# EAGLE design BreakoutBoard (EAGLE 9.6.2)

## Sheet 1 of 2
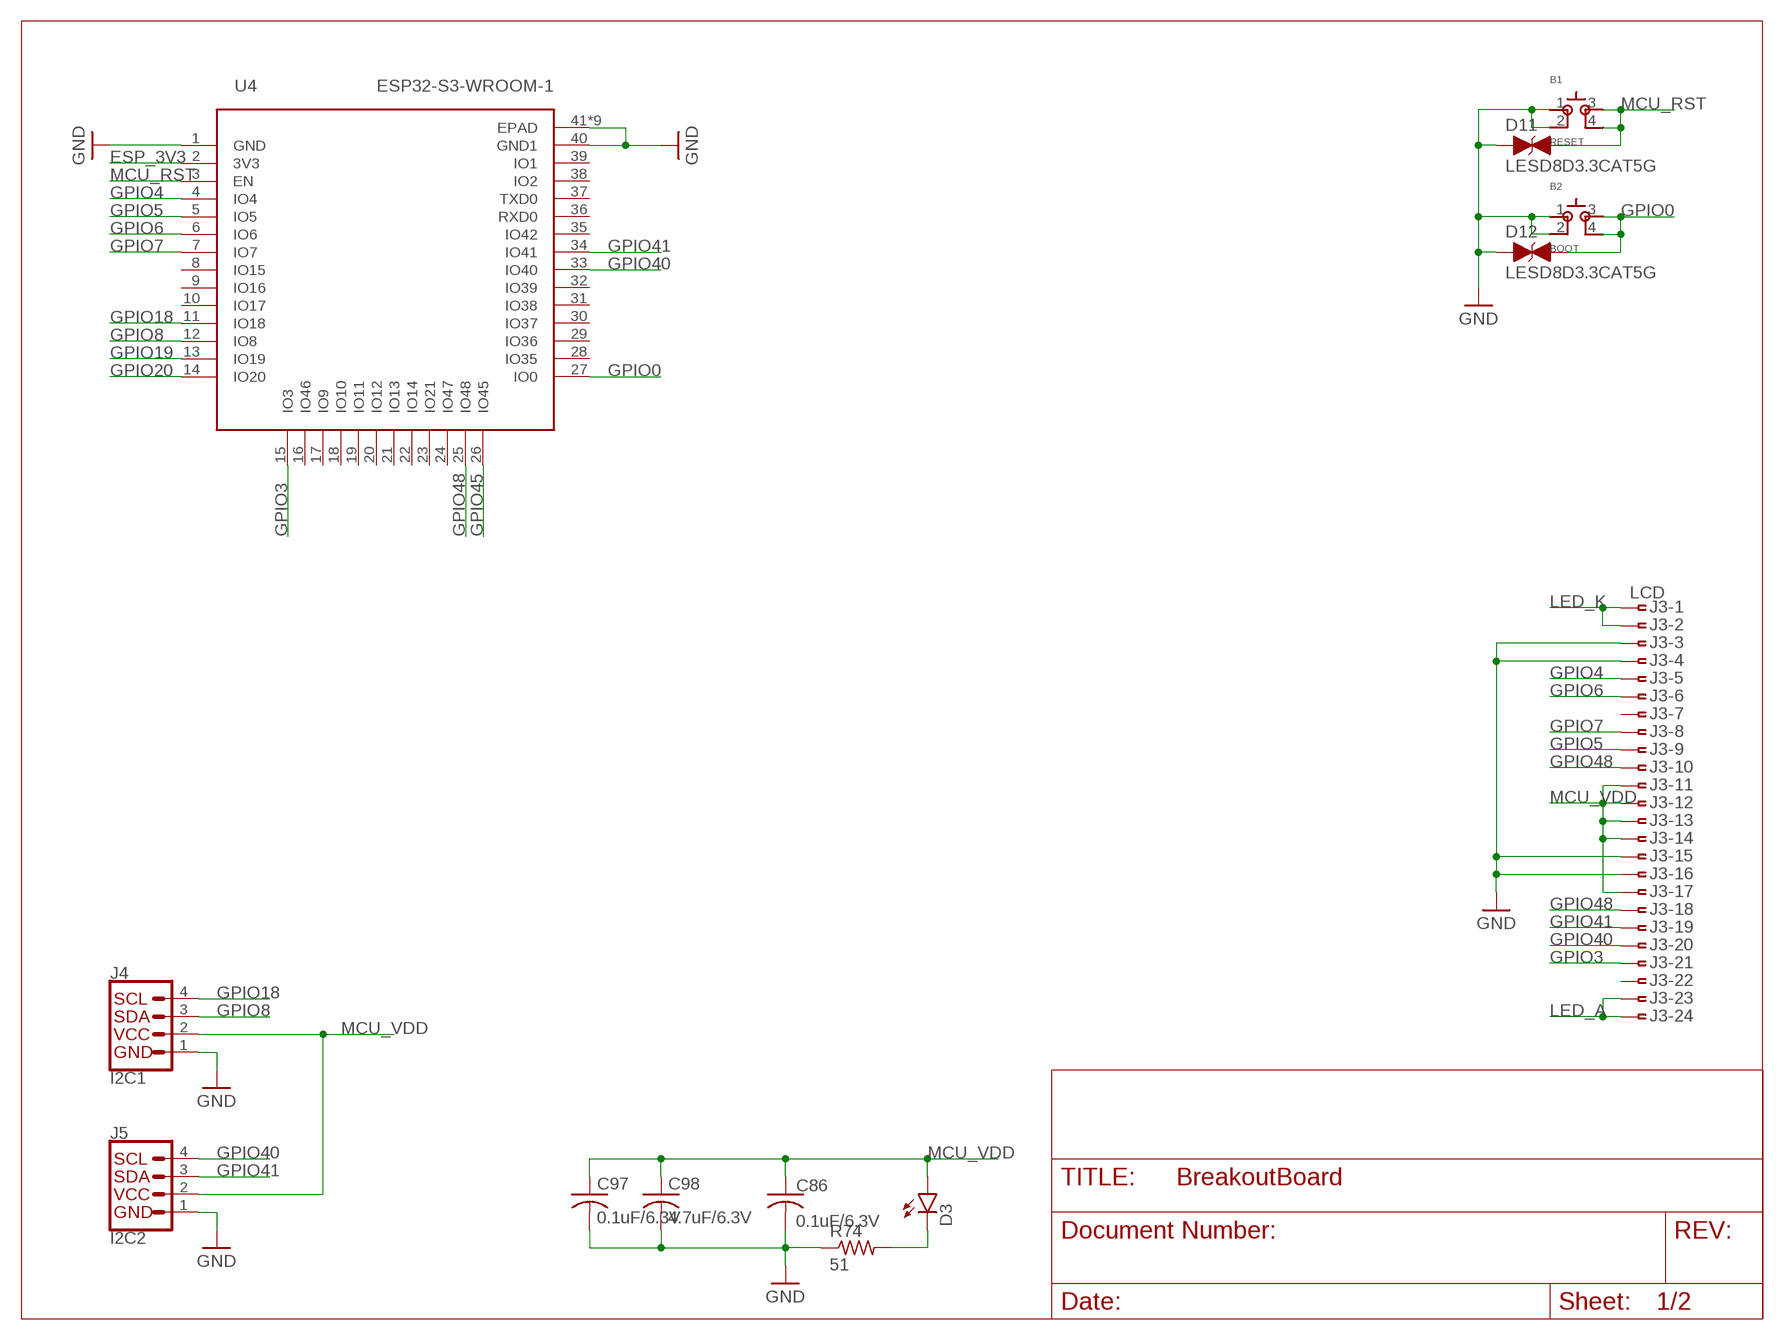
[diagram p0: schematic, sheet 1]

### Parts
B1  RESET  SKSCLDE010  [SKSCLDE010]
B2  BOOT  SKSCLDE010  [SKSCLDE010]
C86  0.1uF/6.3V  C-USC0402  [C0402]
C97  0.1uF/6.3V  C-USC0402  [C0402]
C98  4.7uF/6.3V  C-USC0402  [C0402]
D3  LEDCHIPLED_1206  [CHIPLED_1206]
D11  LESD8D3.3CAT5G  [SOD882]
D12  LESD8D3.3CAT5G  [SOD882]
J3  LCD  ER-CON0.4-24  [OK-24F024-04]
J4  I2C1  QWIIC_CONNECTOR  [JST04_1MM_VERT]
J5  I2C2  QWIIC_CONNECTOR  [JST04_1MM_VERT]
R74  51  R-US_R0201  [R0201]
U4  ESP32-S3-WROOM-1  [QFN60_ESP32-S3-WROOM-1_EXP]

### Nets
ESP_3V3: U4.2(3V3) ; also sheet 2
GND: B1.1 B1.2 B2.1 B2.2 C86.2 C97.2 C98.2 D11.A D12.A J3.3 J3.4 J3.15 J3.16 J4.1 J5.1 R74.1 U4.1(GND) U4.40(GND1) U4.41(EPAD) U4.42(EPAD) U4.43(EPAD) U4.44(EPAD) U4.45(EPAD) U4.46(EPAD) U4.47(EPAD) U4.48(EPAD) U4.49(EPAD) ; also sheet 2
GPIO0: B2.3 B2.4 D12.C U4.27(IO0)
GPIO3: J3.21 U4.15(IO3)
GPIO4: J3.5 U4.4(IO4)
GPIO5: J3.9 U4.5(IO5)
GPIO6: J3.6 U4.6(IO6)
GPIO7: J3.8 U4.7(IO7)
GPIO8: J4.3 U4.12(IO8)
GPIO18: J4.4 U4.11(IO18)
GPIO19: U4.13(IO19) ; also sheet 2
GPIO20: U4.14(IO20) ; also sheet 2
GPIO40: J3.20 J5.4 U4.33(IO40)
GPIO41: J3.19 J5.3 U4.34(IO41)
GPIO45: U4.26(IO45) ; also sheet 2
GPIO48: J3.10 J3.18 U4.25(IO48) ; also sheet 2
LED_A: J3.23 J3.24 ; also sheet 2
LED_K: J3.1 J3.2 ; also sheet 2
MCU_RST: B1.3 B1.4 D11.C U4.3(EN) ; also sheet 2
MCU_VDD: C86.1 C97.1 C98.1 D3.A J3.11 J3.12 J3.13 J3.14 J3.17 J4.2 J5.2 ; also sheet 2
N$2: D3.C R74.2
Unconnected: J3.7 J3.22 U4.8(IO15) U4.9(IO16) U4.10(IO17) U4.16(IO46) U4.17(IO9) U4.18(IO10) U4.19(IO11) U4.20(IO12) U4.21(IO13) U4.22(IO14) U4.23(IO21) U4.24(IO47) U4.28(IO35) U4.29(IO36) U4.30(IO37) U4.31(IO38) U4.32(IO39) U4.35(IO42) U4.36(RXD0) U4.37(TXD0) U4.38(IO2) U4.39(IO1)

## Sheet 2 of 2
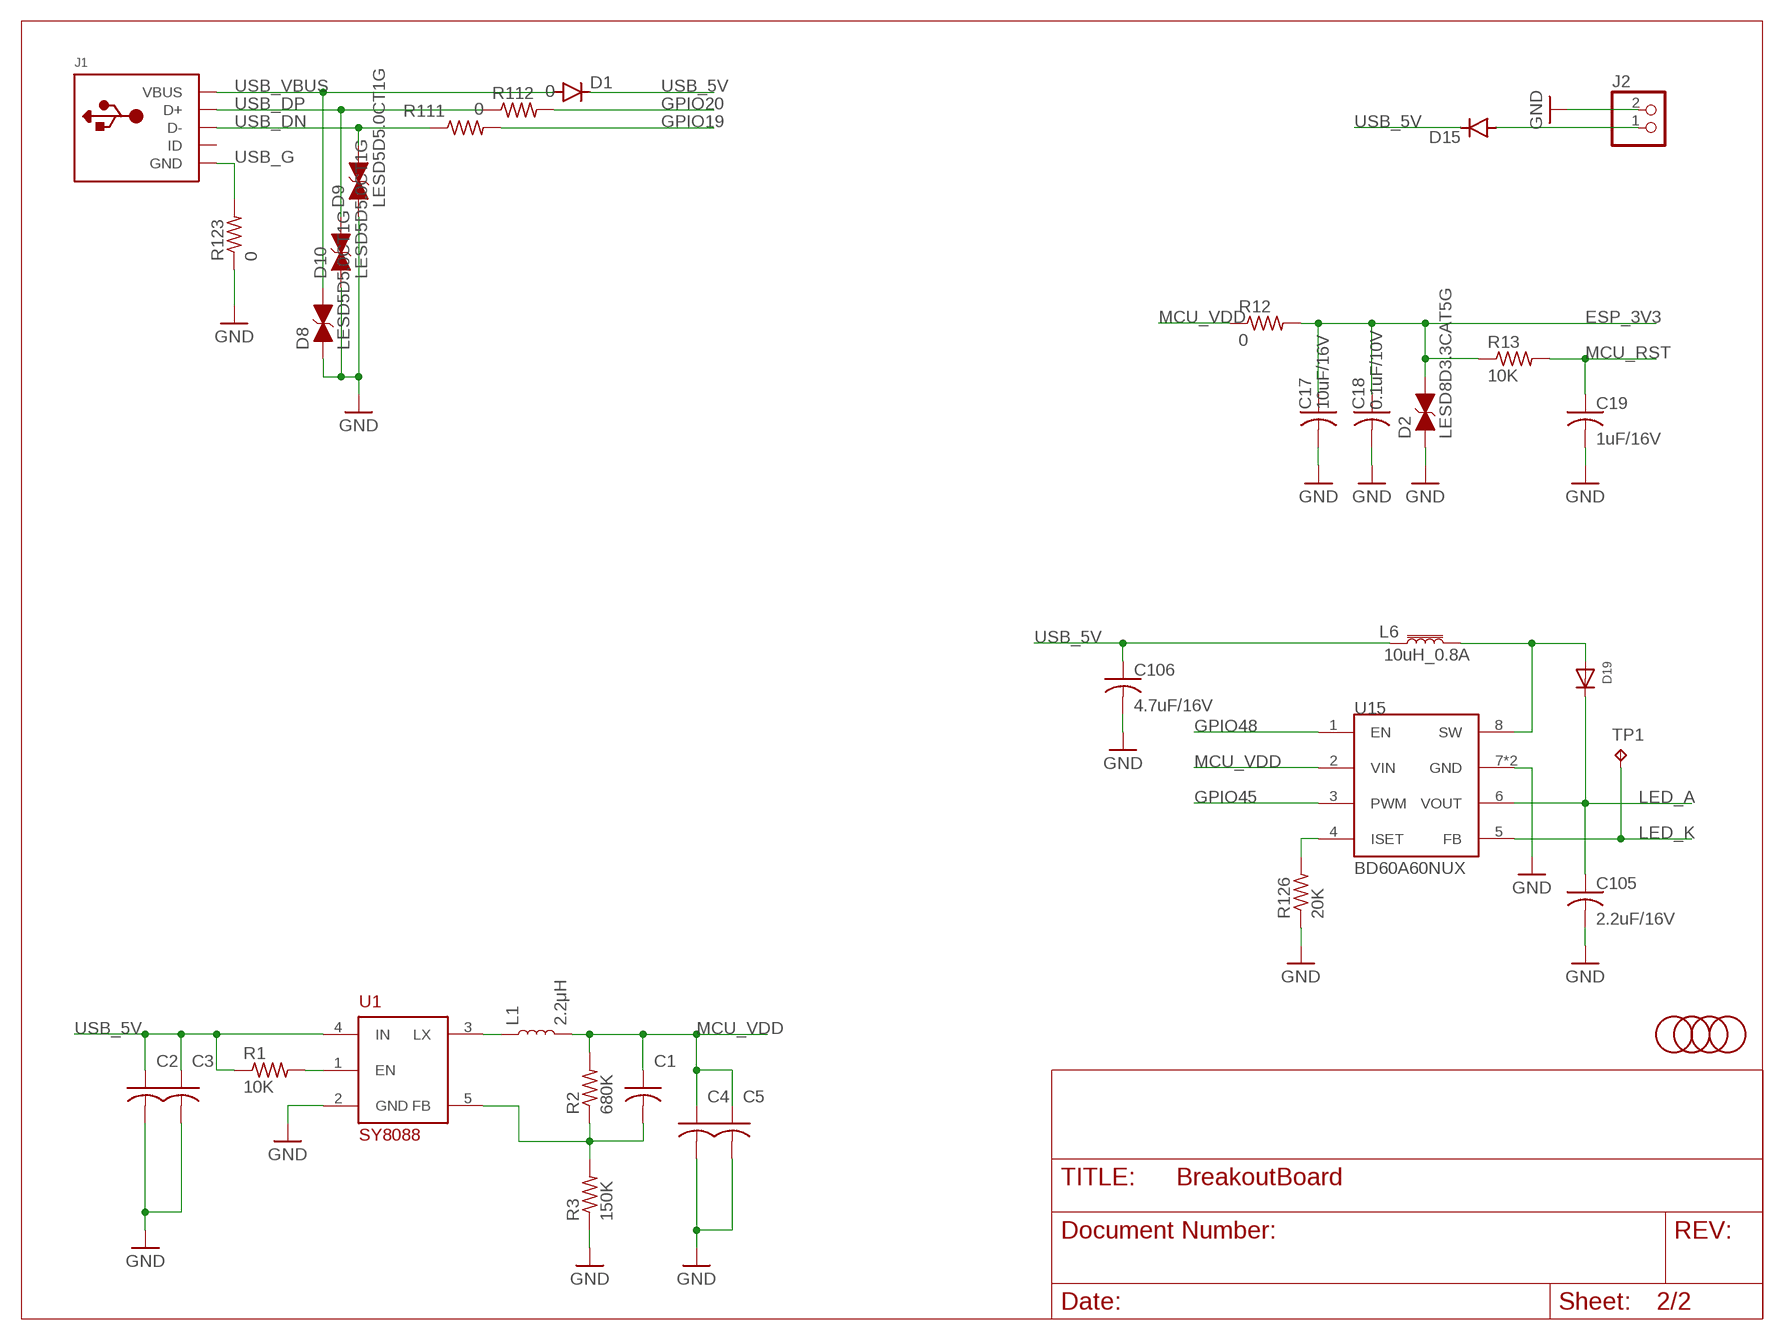
[diagram p1: schematic, sheet 2]

### Parts
C1  22pF/50V  C-USC0402  [C0402]
C2  10uF/16V  C-USC0603  [C0603]
C3  0.1uF/10V  C-USC0603  [C0603]
C4  0.1uF/10V  C-USC0402  [C0402]
C5  10uF/16V  C-USC0402  [C0402]
C17  10uF/16V  C-USC0603  [C0603]
C18  0.1uF/10V  C-USC0402  [C0402]
C19  1uF/16V  C-USC0402  [C0402]
C105  2.2uF/16V  C-USC0603  [C0603]
C106  4.7uF/16V  C-USC0603  [C0603]
D1  DIODE-SOD123  [SOD123]
D2  LESD8D3.3CAT5G  [SOD882]
D8  LESD5D5.0CT1G  [SOD523]
D9  LESD5D5.0CT1G  [SOD523]
D10  LESD5D5.0CT1G  [SOD523]
D15  DIODE-SOD123  [SOD123]
D19  DIODESOD-523  [SOD-523]
J1  MICROBUILDER_USBMICRO_20329  [MICROBUILDER_4UCONN_20329]
J2  JST_2PIN-SMT  [JST-PH-2-SMT]
L1  2.2μH  2.2μH-4X4-2.2μH-3A-45MOHM  [INDUCTOR_4X4MM]
L6  10uH_0.8A  SRN3010TA  [L3012S]
R1  10K  R-US_R0402  [R0402]
R2  680K  R-US_R0402  [R0402]
R3  150K  R-US_R0402  [R0402]
R12  0  R-US_R0603  [R0603]
R13  10K  R-US_R0402  [R0402]
R111  0  R-US_R0201  [R0201]
R112  0  R-US_R0201  [R0201]
R123  0  R-US_R0603  [R0603]
R126  20K  R-US_R0402  [R0402]
TP1  TPTP06R  [TP06R]
U1  SY8088  [SOT23-5]
U15  BD60A60NUX  [VSON008X2030]
U$1  FIDUCIAL  [FIDUCIAL_1MM]
U$2  FIDUCIAL  [FIDUCIAL_1MM]
U$4  FIDUCIAL  [FIDUCIAL_1MM]
U$5  FIDUCIAL  [FIDUCIAL_1MM]

### Nets
ESP_3V3: C17.1 C18.1 D2.C R12.2 R13.1 ; also sheet 1
GND: C2.2 C3.2 C4.2 C5.2 C17.2 C18.2 C19.2 C105.2 C106.2 D2.A D8.A D9.A D10.A J2.2 R3.1 R123.1 R126.1 U1.2(GND) U15.7(GND) U15.PAD(GND) ; also sheet 1
GPIO19: R111.2 ; also sheet 1
GPIO20: R112.2 ; also sheet 1
GPIO45: U15.3(PWM) ; also sheet 1
GPIO48: U15.1(EN) ; also sheet 1
LED_A: C105.1 D19.K(C) U15.6(VOUT) ; also sheet 1
LED_K: TP1.TP U15.5(FB) ; also sheet 1
MCU_RST: C19.1 R13.2 ; also sheet 1
MCU_VDD: C1.1 C4.1 C5.1 L1.P$2 R2.2 R12.1 U15.2(VIN) ; also sheet 1
N$1: D19.A L6.P$2 U15.8(SW)
N$4: D15.A J2.1
N$6: R1.2 U1.1(EN)
N$7: L1.P$1 U1.3(LX)
N$8: C1.2 R2.1 R3.2 U1.5(FB)
N$9: R126.2 U15.4(ISET)
USB_5V: C2.1 C3.1 C106.1 D1.C D15.C L6.P$1 R1.1 U1.4(IN)
USB_DN: D9.C J1.D- R111.1
USB_DP: D10.C J1.D+ R112.1
USB_G: J1.BASE@1(GND) J1.BASE@2(GND) J1.GND J1.SPRT@1(GND) J1.SPRT@2(GND) J1.SPRT@3(GND) J1.SPRT@4(GND) R123.2
USB_VBUS: D1.A D8.C J1.VBUS
Unconnected: J1.ID

## Library data of the parts
B1 B2 = alps:SKSCLDE010; LCSC: C115362
C1 = rcl:C-US: CAPACITOR, American symbol; LCSC: C106203; SPICEPREFIX: C
C2 C5 C17 = rcl:C-US: CAPACITOR, American symbol; LCSC: C86275; SPICEPREFIX: C
C3 C4 C18 = rcl:C-US: CAPACITOR, American symbol; LCSC: C161163; SPICEPREFIX: C
C19 = rcl:C-US: CAPACITOR, American symbol; LCSC: C77007; SPICEPREFIX: C
C86 C97 = rcl:C-US: CAPACITOR, American symbol; LCSC: C541406; SPICEPREFIX: C
C98 = rcl:C-US: CAPACITOR, American symbol; LCSC: C106859; SPICEPREFIX: C
C105 = rcl:C-US: CAPACITOR, American symbol; LCSC: C106853; SPICEPREFIX: C
C106 = rcl:C-US: CAPACITOR, American symbol; LCSC: C277476; SPICEPREFIX: C
D1 D15 = diode:DIODE-: DIODE; LCSC: C511872
D2 D11 D12 = discrete:LESD8D3.3CAT5G: LESD8D3.3CAT5G; LCSC: C172409
D3 = led:LED: LED OSRAM: - CHIPLED LG R971, LG N971, LY N971, LG Q971, LY Q971, LO R971, LY R971 LH N974, LH R974 LS Q976, LO Q976, LY Q976 LO Q996 - Hyper CHIPLED LW Q18S LB Q993, LB Q99A, LB R99A - SideLED LS A670, LO A670, LY A670, LG A670, LP A670 LB A673, LV A673, LT A673, LW A673 LH A674 LY A675 LS A676, LA A676, LO A676, LY A676, LW A676 LS A679, LY A679, LG A679 - Hyper Micro SIDELED® LS Y876, LA Y876, LO Y876, LY Y876 LT Y87S - SmartLED LW L88C, LW L88S LB L89C, LB L89S, LG L890 LS L89K, LO L89K, LY L89K LS L896, LA L896, LO L896, LY L896 - TOPLED LS T670, LO T670, LY T670, LG T670, LP T670 LSG T670, LSP T670, LSY T670, LOP T670, LYG T670 LG T671, LOG T671, LSG T671 LB T673, LV T673, LT T673, LW T673 LH T674 LS T676, LA T676, LO T676, LY T676, LB T676, LH T676, LSB T676, LW T676 LB T67C, LV T67C, LT T67C, LS T67K, LO T67K, LY T67K, LW E67C LS E67B, LA E67B, LO E67B, LY E67B, LB E67C, LV E67C, LT E67C LW T67C LS T679, LY T679, LG T679 LS T770, LO T770, LY T770, LG T770, LP T770 LB T773, LV T773, LT T773, LW T773 LH T774 LS E675, LA E675, LY E675, LS T675 LS T776, LA T776, LO T776, LY T776, LB T776 LHGB T686 LT T68C, LB T68C - Hyper Mini TOPLED® LB M676 - Mini TOPLED Santana® LG M470 LS M47K, LO M47K, LY M47K Source: http://www.osram.convergy.de LUXEON: - LUMILED® LXK2-PW12-R00, LXK2-PW12-S00, LXK2-PW14-U00, LXK2-PW14-V00 LXK2-PM12-R00, LXK2-PM12-S00, LXK2-PM14-U00 LXK2-PE12-Q00, LXK2-PE12-R00, LXK2-PE12-S00, LXK2-PE14-T00, LXK2-PE14-U00 LXK2-PB12-K00, LXK2-PB12-L00, LXK2-PB12-M00, LXK2-PB14-N00, LXK2-PB14-P00, LXK2-PB14-Q00 LXK2-PR12-L00, LXK2-PR12-M00, LXK2-PR14-Q00, LXK2-PR14-R00 LXK2-PD12-Q00, LXK2-PD12-R00, LXK2-PD12-S00 LXK2-PH12-R00, LXK2-PH12-S00 LXK2-PL12-P00, LXK2-PL12-Q00, LXK2-PL12-R00 Source: www.luxeon.com KINGBRIGHT: KA-3528ASYC Source: www.kingbright.com; LCSC: C375534
D8-D10 = discrete:LESD5D5.0CT1G: LESD5D5.0CT1G ESD Protection; LCSC: C383211
D19 = adafruit:DIODE: Diode SMADIODE - SMA Surface Mount Package 20V 1A Schottky Diode Digikey: 641-1014-6-ND DO-1N4148 - Through Hole Small Current Diode SOD-123 20V 1 A (.5mV Vf) Schottky Diode - Digikey: MBRX120TPMSCT-ND SOD-323 10V 570mA (.38mV Vf, 3ns) Schottky Diode - Digikey: ZLLS410CT-ND SOD-523 30V 30mA Schottky Diode (RB751S-40TE61) - Digikey: RB751S-40TE61CT-ND SOT23-R/W - SOT23 Package (R = Solder Paste/Reflow Ovens, W = Hand-Soldering) BAT54Film 40V 300mA - Digikey: 497-7162-1-ND; LCSC: C253516
J1 = Adafruit ItsyBitsy nRF52840 Express:MICROBUILDER_USB: USB Connectors USBMINIB - Surface Mount Female Mini-B USB Connector 4UConnector: 06564; LCSC: C40946
J2 = adafruit:JST_2PIN: JST 2-Pin Connectors of various flavors SMT-RA (S2B-PH-SM4) 4UConnector #17311 SMT (B2B-PH-SM4) THM-RA (S2B-PH) THM (B2B-PH); LCSC: C64658
J3 = ER-CON0.4-24P:ER-CON0.4-24: ER-CON0.4-24 connector
J4 J5 = SparkFun-Connectors:QWIIC_CONNECTOR: SparkFun I2C Standard Qwiic Connector An SMD 1mm pitch JST connector makes it easy and quick (get it? Qwiic?) to connect I2C devices to each other. The Qwiic system <http://www.sparkfun.com/qwiic> enables fast and solderless connection between popular platforms and various sensors and actuators. We carry 200mm <https://www.sparkfun.com/products/14204>, 100mm <https://www.sparkfun.com/products/14205>, 50mm <https://www.sparkfun.com/products/14206>, and breadboard friendly <https://www.sparkfun.com/products/14207> Qwiic cables. We also offer 10 pcs strips <https://www.sparkfun.com/products/14323> the SMD connectors.; LCSC: C495539; PROD_ID: CONN-14483; VALUE: Vertical Qwiic Connector
L1 = SparkFun-Coils:2.2μH: 2.2μH Inductor Resist changes in electrical current. Basically a coil of wire. SparkFun Products: SparkFun Edge - HX711 <https://www.sparkfun.com/products/15170>; LCSC: C370436; PROD_ID: NDUC-13770
L6 = discrete:SRN3010TA: Bourns SRN3010TA Semi-Shielded Power Inductors; LCSC: C518881
R1 R13 = rcl:R-US_: RESISTOR, American symbol; LCSC: C60490; SPICEPREFIX: R
R2 = rcl:R-US_: RESISTOR, American symbol; LCSC: C163456; SPICEPREFIX: R
R3 = rcl:R-US_: RESISTOR, American symbol; LCSC: C93947; SPICEPREFIX: R
R12 R123 = rcl:R-US_: RESISTOR, American symbol; LCSC: C100044; SPICEPREFIX: R
R74 = rcl:R-US_: RESISTOR, American symbol; LCSC: C163499; SPICEPREFIX: R
R111 R112 = rcl:R-US_: RESISTOR, American symbol; LCSC: C106227; SPICEPREFIX: R
R126 = rcl:R-US_: RESISTOR, American symbol; LCSC: C326980; SPICEPREFIX: R
TP1 = testpad:TP: Test pad
U1 = discrete:SY8088: High Efficiency 1.5MHz, 1A Synchronous Step Down Regulator; LCSC: C79313
U4 = espressif:ESP32-S3-WROOM-1: ESP32-S3
U15 = discrete:BD60A60NUX: BD60A60NUX White LED Driver With PWM Brightness Control; LCSC: C2678724
U$1 U$2 U$4 U$5 = adafruit:FIDUCIAL: For use by pick and place machines to calibrate the vision/machine, 1mm By microbuilder.eu

## Board
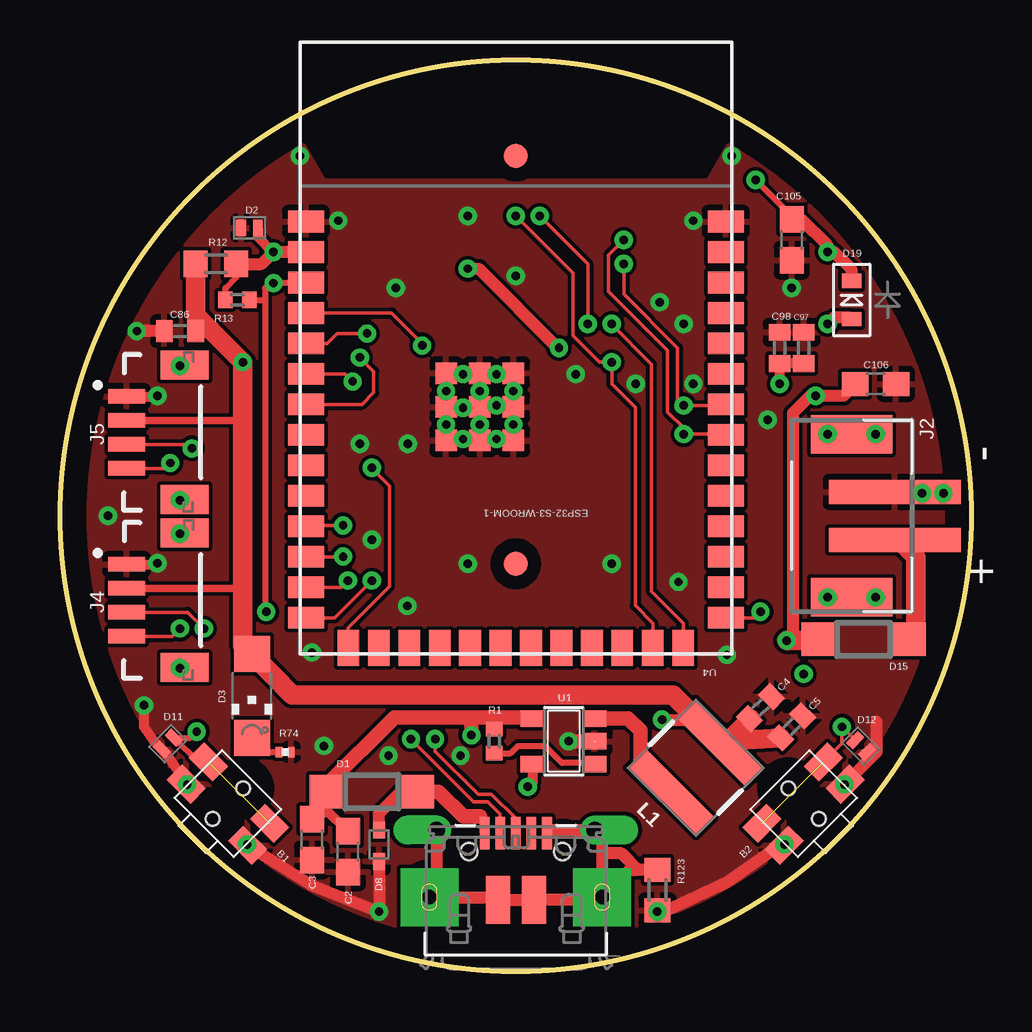
[diagram p2: board, top side]
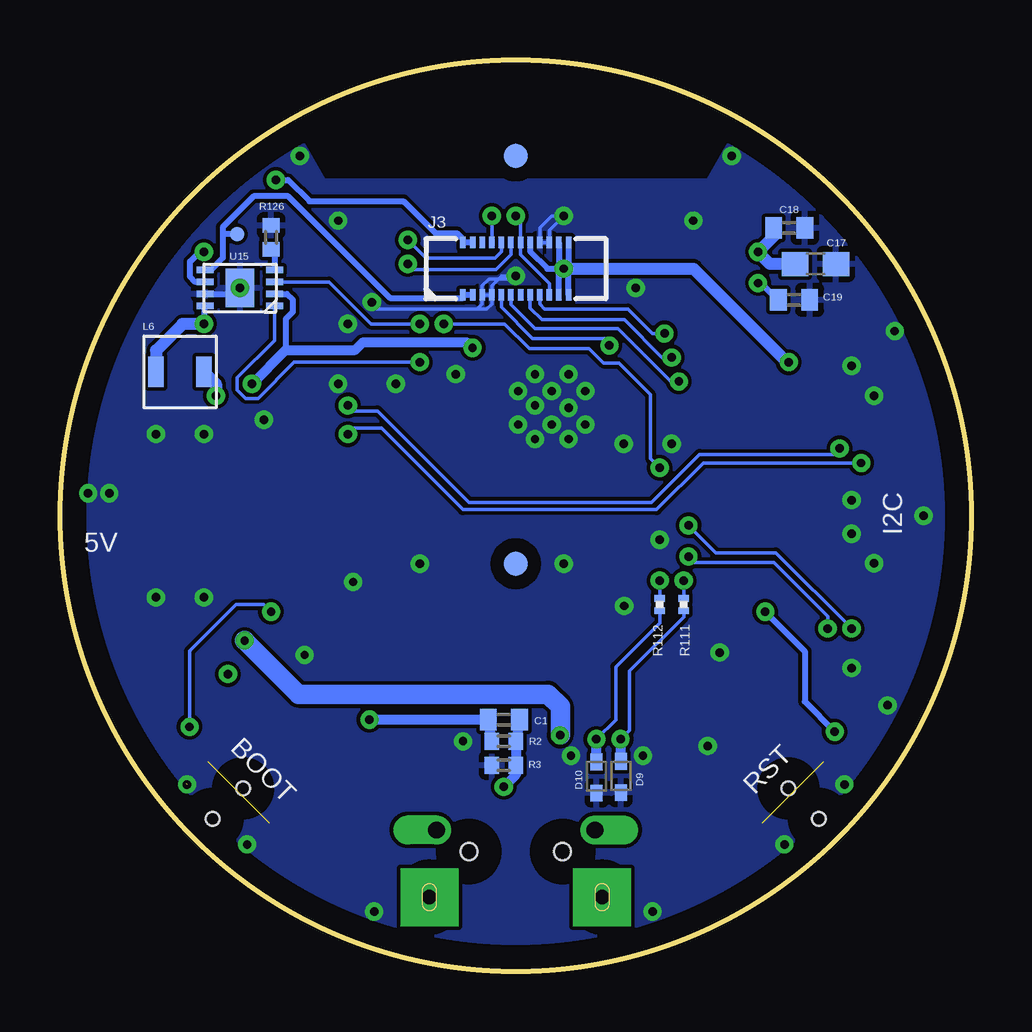
[diagram p3: board, bottom side, seen from below]

Size 38 x 38 mm. Coordinates in mm from the lower left corner, seen from the top.
Outline: circle at 19,19 radius 19
Copper layers (1*16): Top 0.035mm / dielectric 1.5mm / Bottom 0.035mm
Design rules "default": minimum track width 6mil, minimum drill 0.35mm, track to track 6mil, track to pad 6mil, pad to pad 6mil, via to via 6mil, smd to smd 6mil, copper to edge 40mil, drill to drill 6mil, minimum pad ring 10mil, minimum via ring 8mil, stop-mask expansion 4mil, vias tented up to drill 0mil, thermal gap 10mil

### Footprints (pad centres in the part's own frame; a part is rotated, then mirrored left to right if it is on the bottom)
SKSCLDE010 = smd 1.4 x 0.9: 1 -1.8,-0.65; 2 1.8,-0.65; 3 -1.8,0.65; 4 1.8,0.65 | hole 0.55: 0,0.9; 0,-0.9
C0402 = smd 0.7 x 0.9: 1 -0.65,0; 2 0.65,0
C0603 = smd 1.1 x 1: 1 -0.85,0; 2 0.85,0
SOD123 = smd 1.4 x 1.4: A 1.9,0; C -1.9,0
SOD882 = smd 0.4 x 0.7: A 0.35,0; C -0.35,0
CHIPLED_1206 = smd 1.5 x 1.5: A 0,-1.75; C 0,1.75
SOD523 = smd 0.7 x 0.5: A 0.7,0; C -0.6,0
SOD-523 = smd 0.8 x 0.6: A 0,-0.8; K 0,0.8
MICROBUILDER_4UCONN_20329 = smd 1 x 2: BASE@1 -0.75,-2; BASE@2 0.75,-2 | smd 0.4 x 1.35: D+ 0,0.775; D- -0.65,0.775; GND 1.3,0.775; ID 0.65,0.775; VBUS -1.3,0.775 | drill 0.7 offset: SPRT@1 -3.3,0.9; SPRT@2 3.3,0.9 | drill 0.6 pad 2.413 square: SPRT@3 -3.6,-1.9; SPRT@4 3.6,-1.9 | hole 0.7: -1.95,0; 1.95,0
JST-PH-2-SMT = smd 1 x 5.5: 1 -1,-1.8; 2 1,-1.8 | smd 1.6 x 3.4: NC1 -3.4,0; NC2 3.4,0
OK-24F024-04 = smd 0.47 x 0.23: 1 -1.095,2.2; 2 -1.095,1.8; 3 -1.095,1.4; 4 -1.095,1; 5 -1.095,0.6; 6 -1.095,0.2; 7 -1.095,-0.2; 8 -1.095,-0.6; 9 -1.095,-1; 10 -1.095,-1.4; 11 -1.095,-1.8; 12 -1.095,-2.2; 13 1.095,-2.2; 14 1.095,-1.8; 15 1.095,-1.4; 16 1.095,-1; 17 1.095,-0.6; 18 1.095,-0.2; 19 1.095,0.2; 20 1.095,0.6; 21 1.095,1; 22 1.095,1.4; 23 1.095,1.8; 24 1.095,2.2
JST04_1MM_VERT = smd 0.6 x 1.55: 1 -1.478,0.775; 2 -0.478,0.775; 3 0.522,0.775; 4 1.522,0.775 | smd 1.2 x 2: NC1 -2.778,3.2; NC2 2.822,3.2
INDUCTOR_4X4MM = smd 4.089 x 1.143: P$1 0,1.473; P$2 0,-1.473
L3012S = smd 1.27 x 0.635: P$1 0,1; P$2 0,-1
R0402 = smd 0.6 x 0.7: 1 -0.5,0; 2 0.5,0
R0603 = smd 1 x 1.1: 1 -0.85,0; 2 0.85,0
R0201 = smd 0.28 x 0.43: 1 -0.255,0; 2 0.255,0
TP06R = smd 0.6 x 0.6: TP 0,0
SOT23-5 = smd 0.69 x 0.99: 1 -0.95,-1.29; 2 0,-1.29; 3 0.95,-1.29; 4 0.95,1.3; 5 -0.95,1.3
QFN60_ESP32-S3-WROOM-1_EXP = smd 1.5 x 0.9: 1 -8.75,8.26; 2 -8.75,6.99; 3 -8.75,5.72; 4 -8.75,4.45; 5 -8.75,3.18; 6 -8.75,1.91; 7 -8.75,0.64; 8 -8.75,-0.63; 9 -8.75,-1.9; 10 -8.75,-3.17; 11 -8.75,-4.44; 12 -8.75,-5.71; 13 -8.75,-6.98; 14 -8.75,-8.25; 27 8.75,-8.25; 28 8.75,-6.98; 29 8.75,-5.71; 30 8.75,-4.44; 31 8.75,-3.17; 32 8.75,-1.9; 33 8.75,-0.63; 34 8.75,0.64; 35 8.75,1.91; 36 8.75,3.18; 37 8.75,4.45; 38 8.75,5.72; 39 8.75,6.99; 40 8.75,8.26 | smd 0.9 x 1.5: 15 -6.985,-9.5; 16 -5.715,-9.5; 17 -4.445,-9.5; 18 -3.175,-9.5; 19 -1.905,-9.5; 20 -0.635,-9.5; 21 0.635,-9.5; 22 1.905,-9.5; 23 3.175,-9.5; 24 4.445,-9.5; 25 5.715,-9.5; 26 6.985,-9.5 | smd 0.9 x 0.9: 41 -2.9,1.94; 42 -1.5,1.94; 43 -0.1,1.94; 44 -2.9,0.54; 45 -1.5,0.54; 46 -0.1,0.54; 47 -2.9,-0.86; 48 -1.5,-0.86; 49 -0.1,-0.86
VSON008X2030 = smd 0.27 x 0.7: 1 -0.75,-1.45; 2 -0.25,-1.45; 3 0.25,-1.45; 4 0.75,-1.45; 5 0.75,1.45; 6 0.25,1.45; 7 -0.25,1.45; 8 -0.75,1.45 | smd 1.6 x 1.2: PAD 0,0
FIDUCIAL_1MM = smd 1 x 1: 1 0,0

### Placement (x,y rotation side)
B1  7,7 315 top
B2  31,7 45 top
C1  19.5,10.5 0 bottom
C2  12,5 270 top
C3  10.5,5.5 270 top
C4  29.2,11 45 top
C5  30.5,10.2 45 top
C17  6.5,29.5 0 bottom
C18  7.6,31 0 bottom
C19  7.4,28 0 bottom
C86  5,26.7 180 top
C97  31,26 90 top
C98  30,26 90 top
C105  30.5,30.5 270 top
C106  34,24.5 0 top
D1  13,7.5 0 top
D2  7.9,31 180 top
D3  8,11.5 180 top
D8  13.3,5.3 270 top
D9  14.62,8.16 270 bottom
D10  15.63,8.14 270 bottom
D11  4.5,9.5 225 top
D12  33.4,9.4 315 top
D15  33.5,13.85 0 top
D19  33,28 0 top
J1  19,5 0 top
J2  33,19 90 top
J3  19,29.3 90 bottom
J4  2,15.5 270 top
J5  2,22.5 270 top
L1  26.5,8.5 135 top
L6  33,25 270 bottom
R1  18.1,9.6 270 top
R2  19.5,9.6 180 bottom
R3  19.5,8.6 0 bottom
R12  6.5,29.5 0 top
R13  7.4,28 0 top
R74  9.39,9.15 180 top
R111  12,15.3 90 bottom
R112  13,15.3 90 bottom
R123  24.91,3.4 90 top
R126  29.2,30.6 270 bottom
TP1  30.61,30.73 0 bottom
U1  21,9.6 90 top
U4  19,23 0 top
U15  30.5,28.5 90 bottom
U$1  19,17 0 bottom
U$2  19,34 0 bottom
U$4  19,34 0 top
U$5  19,17 0 top

### Tracks (layer width: path | path; a pad name or v marks a point on that pad's centre or on a via)
ESP_3V3  (via drill 0.35)
  Top 0.254: R13.1 6.9,28.49 7.35,28.94 C17.1
  Top 0.406: C18.1 8.25,30.62 8.87,30 v8.9,30
  Top 0.508: U4.2 v8.9,30 8.4,29.5 C17.1
  Bottom 0.508: C17.1 8.4,29.5 v8.9,30 8.25,30.65 C18.1
GND  (via drill 0.35)  (1 unrouted)
  Top 0.152: 4.4,9.11 D11.A 3.97,9.53 | v5.3,7.8 5.3,7.82 | R123.1 24.89,2.55 | 30.19,5.09 B2.1
  Top 0.406: J5.1 4.04,23.98 v4.06,24 | J4.1 4.02,16.98 v4.06,17.02 | 5.3,7.82 4.4,9.11 | 3.97,9.53 3.5,10.21 v3.5,11.1
  Top 0.508: D8.A v13.3,2.5 10.5,3.6 B1.2 | C86.2 3.21,26.7 v3.21,26.7 | v32.7,7.8 34.04,9.14 34.04,10.41 | R123.1 25.27,2.55 27.82,3.73 30.04,5.29
  Top 0.61: v21.2,9.6 U1.2
  Bottom 0.152: J3.4 J3.3 | J3.3 20.4,28.59 20.11,28.87 19.13,28.87 v19,29 19.59,29 20,28.59 J3.4 | J3.3 20.4,27.82 20.61,27.61 24.67,27.61 24.95,27.9 v25,27.9 25,27.82 24.8,27.61 20.21,27.61 20,27.82 J3.4 | J3.15 J3.16 18,31.01 17.51,31.5 v17,31.5 17.6,30.9 J3.15
  Bottom 0.254: U15.7 30.75,28.25 U15.PAD
  other vias: 5,18.25 5,19.65 5,25.25 5,12.65 32,22.4 34,22.4 32,15.6 34,15.6 7.8,5.3 24.9,2.5 30.2,5.3 26.4,31.3 11.6,31.3 16.8,24.9 18.2,24.9 16.1,24.2 17.5,24.2 18.9,24.2 16.8,23.5 18.2,23.6 16.1,22.8 17.5,22.8 18.9,22.8 16.8,22.2 18.2,22.2 23,17 21.5,24.9 11,9.4 36.83,19.94 35.94,19.94 2,19 17,17 14.48,15.24 25.78,16.24 27.8,13.2 10.5,13.3 16.7,9 13.7,9 30.5,28.5 26,27 28,34 24,24.5 14,28.5 12.5,22 14.5,22 13,18 26.4,24.5 29.5,23 10,34
  pour Bottom: 9,36.5 arc60 -1,19 arc90 19,-1 arc90 39,19 arc60 29,36.5 27,33 11,33
  pour Top: 9,36.5 arc60 -1,19 arc90 19,-1 arc90 39,19 arc60 29,36.5 27,33 11,33
GPIO0  (via drill 0.35)  (1 unrouted)
  Top 0.152: U4.27 28.79,14.75 28.95,14.75 v29.2,15 | B2.4 32.6,9.52 v32.6,10.2 | D12.C v32.6,10.2 | v32.6,10.2
  Bottom 0.152: v29.2,15 29.5,15.3 30.65,15.3 32.6,13.36 v32.6,10.2
GPIO3  (via drill 0.35)
  Top 0.152: v20,31.5 22,29.5 v22,27 | U4.15 12.02,14.33 13.73,16.05 13.73,20.23 13,20.97 v13,21
  Bottom 0.152: J3.21 v20,31.5 | v22,27 19.46,27 18.43,25.96 15.95,25.96 15.35,25.37 14.7,25.37 13.38,24.05 13.38,21.38 v13,21
GPIO4  (via drill 0.35)
  Top 0.152: U4.4 13.82,27.45 15.1,26.18 v15.1,26.1
  Bottom 0.152: v15.1,26.1 15.1,26.22 15.28,26.4 18.3,26.4 19.6,27.7 J3.5
GPIO5  (via drill 0.35)
  Top 0.152: U4.5 11.14,26.18 11.55,26.59 12.79,26.59 v12.8,26.6
  Bottom 0.152: J3.9 18,27.82 17.79,27.62 14.32,27.62 13.31,26.6 v12.8,26.6
GPIO6  (via drill 0.35)
  Top 0.152: v12.2,24.6 11.89,24.91 U4.6
  Bottom 0.152: v12.2,24.6 12.54,24.6 14.73,26.8 18.19,26.8 19.2,27.8 J3.6
GPIO7  (via drill 0.35)
  Top 0.152: U4.7 12.59,23.64 13.08,24.13 13.08,25.02 v12.5,25.6
  Bottom 0.152: v12.5,25.6 12.9,25.6 14.48,27.18 17.91,27.18 18.4,27.67 J3.8
GPIO8  (via drill 0.35)
  Top 0.152: J4.3 5.32,14.98 v6,14.3 | v11.8,17.3 v11.79,17.29 U4.12
  Bottom 0.152: v6,14.3 6,14.81 8.24,17.05 11.55,17.05 v11.8,17.3
GPIO18  (via drill 0.35)
  Top 0.152: J4.4 4.68,13.98 v5,14.3 | v11.8,18.6 10.29,18.6 U4.11
  Bottom 0.152: v5,14.3 8.16,17.46 10.66,17.46 v11.8,18.6
GPIO19  (via drill 0.35)
  Top 0.152: v12,16.3 11.72,16.02 U4.13
  Bottom 0.152: R111.2 v12,16.3
GPIO20  (via drill 0.35)
  Top 0.152: v13,16.3 11.45,14.75 U4.14
  Bottom 0.152: R112.2 v13,16.3
GPIO40  (via drill 0.35)
  Top 0.152: J5.4 4.38,20.98 v4.6,21.2 | U4.33 27.72,22.4 v26,22.4 26,22.65 25.32,23.33 25.32,25.89 22.86,28.35 22.86,29.86 v23.5,30.5
  Bottom 0.152: v4.6,21.2 11.19,21.2 13.13,19.25 21.2,19.25 24.6,22.65 25.75,22.65 v26,22.4 | J3.20 19.6,30.01 19.87,29.75 22.75,29.75 v23.5,30.5
GPIO41  (via drill 0.35)
  Top 0.152: J5.3 5.33,21.98 v5.5,21.81 | U4.34 27.71,23.6 v26,23.6 25.75,23.85 25.75,25.99 23.5,28.24 v23.5,29.5
  Bottom 0.152: v5.5,21.81 5.75,21.55 11.34,21.55 13.34,19.56 20.95,19.56 24.77,23.37 25.77,23.37 v26,23.6 | J3.19 19.2,29.89 19.83,29.25 23.25,29.25 v23.5,29.5
GPIO45  (via drill 0.35)
  Top 0.152: U4.26 25.98,14.52 24.67,15.83 24.67,25.3 23,26.96 v23,27
  Bottom 0.152: U15.3 26.78,28.75 25.03,27 v23,27
GPIO48  (via drill 0.35)
  Top 0.152: U4.25 24.71,14.52 23.98,15.25 23.98,23.52 23,24.5 v23,25.4 22.49,25.4 21.38,26.52 21.38,29.12 v19,31.5
  Bottom 0.152: U15.1 29.05,26.31 30.61,24.75 30.61,24.25 30.25,23.89 29.75,23.89 28.24,25.4 v23,25.4 | J3.10 17.6,28.69 18.8,29.89 J3.18 18.8,31.3 v19,31.5
LED_A  (via drill 0.35)
  Top 0.254: v29,33 30.5,31.5 C105.1
  Top 0.508: D19.K 33,29.25 32.25,30 v32,30 32,30.25 30.9,31.35 C105.1
  Bottom 0.254: U15.6 32.36,28.75 32.58,28.97 32.58,29.6 32.18,30 v32,30 | v29,33 28.49,33 27.6,32.11 23.68,32.11 22.34,30.78 21.45,30.78 21.2,30.52 J3.24 J3.23
LED_K
  Bottom 0.254: 31.21,30.73 31.21,31.03 29.93,32.31 28.48,32.31 24.25,28.08 21.2,28.08 J3.1 J3.2 | 31.21,30.73 31.21,29.76 31.72,29.25 U15.5 | TP1.TP 31.21,30.73
MCU_RST  (via drill 0.35)  (1 unrouted)
  Top 0.152: B1.3 5.78,8.73 | 4.77,9.75 D11.C
  Top 0.254: 5.78,8.73 4.77,9.75 | v5.7,10 5.45,9.75 D11.C | 8.55,28.07 8.55,28.48 8.76,28.7 v8.9,28.7 10.23,28.7 U4.3 | 8.55,28.07 8.55,15.05 v8.6,15 | R13.2 8.48,28 8.55,28.07
  Bottom 0.254: v5.7,10 6.95,11.25 6.95,13.35 v8.6,15 | C19.1 8.07,28 8.77,28.7 v8.9,28.7
MCU_VDD  (via drill 0.35)
  Top 0.305: J4.2 7.6,15.98 7.62,16 | J5.2 7.61,22.98 7.62,22.99
  Top 0.406: C97.1 C98.1 v30,24.5
  Top 0.508: v20.8,26 20.76,26 17.46,29.3 v17,29.3 | v25.1,10.5 26.58,10.5 L1.P$2
  Top 0.61: C86.1 6.28,26.74 | 27.6,9.6 L1.P$2
  Top 0.813: C4.1 28.79,10.54 27.8,9.54 L1.P$2 25.55,11.53 9.68,11.53 D3.A 7.62,13.59 7.62,16 7.62,22.99 v7.62,25.4 6.28,26.74 5.65,27.37 R12.1 | C5.1 27.6,9.6
  Bottom 0.254: U15.2 28.54,28.25 28.29,28 28.29,27.5 28.59,27.2 28.59,25.91 | J3.13 16.8,29.5 v17,29.3 | J3.14 17.2,29.5 v17,29.3 | J3.12 16.8,29.1 v17,29.3 | J3.11 17.2,29.1 v17,29.3 | J3.17 18.4,30.01 17.69,29.3 v17,29.3
  Bottom 0.406: v20.8,26 21.02,26.21 25.39,26.21 25.69,25.91 28.59,25.91 v30,24.5 | R2.2 C1.1 v25.1,10.5
  Bottom 0.508: v17,29.3 11.59,29.3 7.65,25.37 v7.62,25.4
N$1  (via drill 0.35)
  Top 0.508: v32,27 32.25,27.25 32.95,27.25 D19.A
  Bottom 0.254: U15.8 32,27.7 v32,27
  Bottom 0.508: v32,27 32.89,27 34,25.89 L6.P$2
N$2
  Top 0.254: R74.2 8.5,9.15 8.05,9.6 D3.C
N$3  (via drill 0.35)
  other vias: 31,12.4
N$4
  Top 0.61: 34.96,18 J2.1
  Top 0.813: D15.A 35.69,14.14 35.69,17.27 34.96,18
N$6
  Top 0.254: R1.2 18.79,9.1 19.09,9.4 20.21,9.4 20.93,8.69 22.25,8.69 U1.1
N$7
  Top 0.61: L1.P$1 24.19,8.73 24.19,10.04 23.68,10.55 U1.3
N$8  (via drill 0.35)
  Top 0.406: U1.5 19.7,7.9 v19.5,7.7
  Bottom 0.406: C1.2 R2.1 R3.2 18.99,8.49 18.99,8.21 v19.5,7.7
N$9
  Bottom 0.254: R126.2 29.05,29.95 U15.4
USB_5V  (via drill 0.35)
  Top 0.406: C2.1 11.1,6.75 D1.C 11.1,6.68 C3.1 | R1.1 18.1,10.54 18.16,10.6
  Top 0.508: D1.C 11.1,7.75 | 19.65,10.6 U1.4 | v30.3,13.8 30.55,14.05 30.55,23.29 31.27,24 v31.5,24 32.65,24 C106.1
  Top 0.61: 11.1,7.75 13.95,10.6 17.14,10.6 | 17.14,10.6 18.16,10.6 19.65,10.6 | v17.15,9.85 17.14,10.6 | D15.C 31.6,13.8
  Top 0.813: v30.3,13.8 31.6,13.8
  Bottom 0.508: v17.14,9.86 v17.15,9.85 | L6.P$1 31.5,24.5 v31.5,24
  Bottom 0.813: v30.3,13.8 28.06,11.56 17.65,11.56 17.14,11.05 v17.14,9.86
USB_DN  (via drill 0.35)
  Top 0.152: v14.63,9.69 17.24,7.08 17.84,7.08 18.34,6.58 18.34,5.79 J1.D-
  Bottom 0.152: v14.63,9.69 14.27,10.04 14.27,12.52 12,14.79 R111.1
  Bottom 0.406: D9.C v14.62,9.67 v14.63,9.69
USB_DP  (via drill 0.35)
  Top 0.152: v15.64,9.69 15.64,9.18 17.44,7.38 18,7.38 19,6.38 J1.D+
  Bottom 0.152: v15.64,9.69 14.83,10.5 14.83,12.71 13,14.54 R112.1
  Bottom 0.406: D10.C v15.63,9.68 v15.64,9.69
USB_G
  Top 0.152: J1.GND 20.43,5.9
  Top 0.508: 20.43,5.9 J1.SPRT@2 22.6,5.6 22.6,5.08 | J1.SPRT@1 15.7,3.4 J1.SPRT@3 18.15,3.1 J1.BASE@1 J1.BASE@2 22.5,3 J1.SPRT@4 | 22.6,5.08 J1.SPRT@4 | R123.2 24.1,4.25 | 24.1,4.25 23.43,4.92 22.76,4.92 22.6,5.08 | J1.SPRT@4 23.75,4.25 24.1,4.25
USB_VBUS
  Top 0.406: J1.VBUS 17.7,6.28 17.52,6.46
  Top 0.508: D8.C 13.3,6.6 14.2,7.5 D1.A
  Top 0.61: 17.52,6.46 16.82,6.46 15.79,7.5 D1.A

### Text on the board
bPlace: I2C | 5V | BOOT | RST